# EAGLE design tinypacket (EAGLE 5.10)
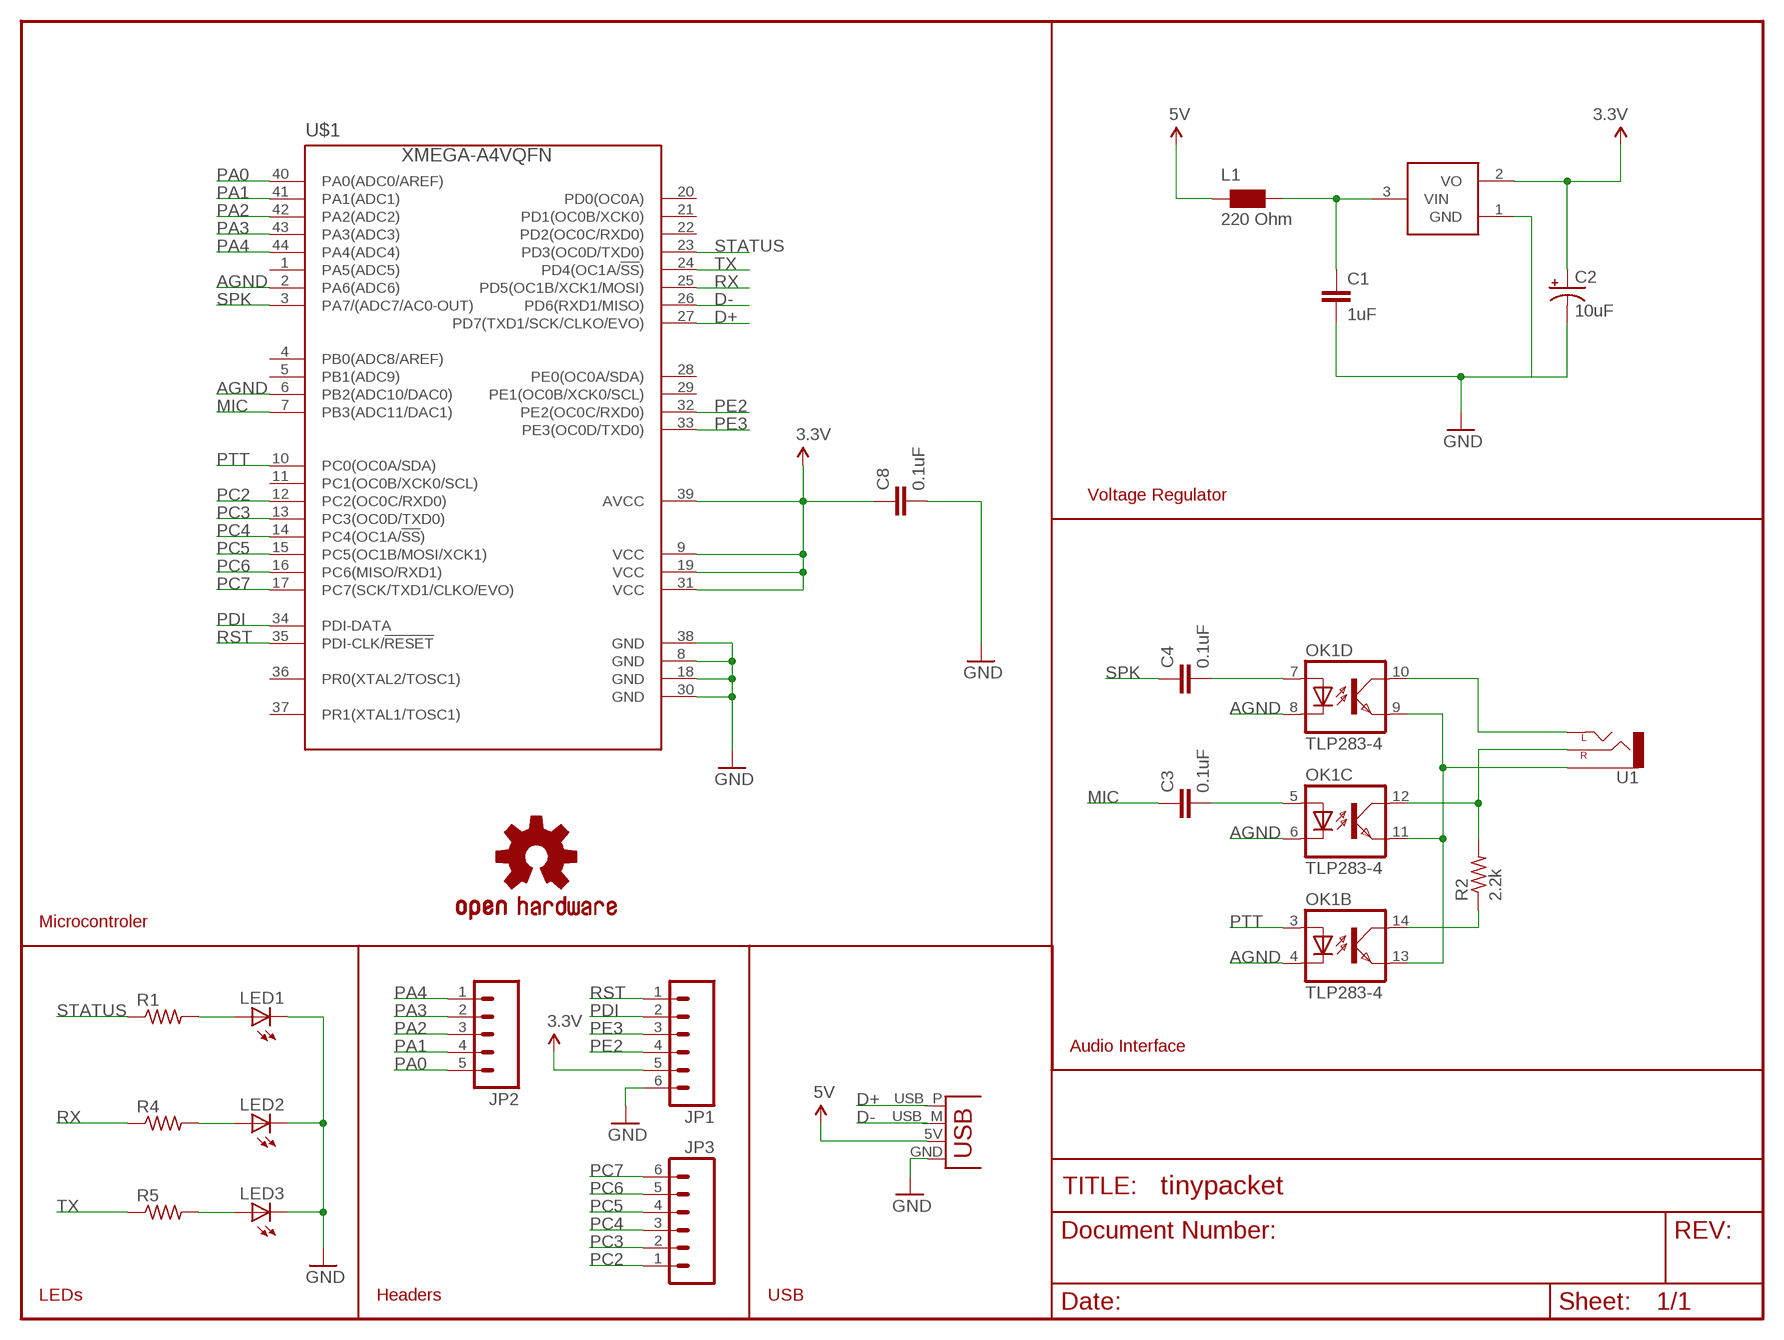
[diagram p0: schematic, sheet 1]

## Parts
C1  1uF  C-EUC0603  [C0603]
C2  10uF  CAP_POL1206  [EIA3216]
C3  0.1uF  C-EUC0603  [C0603]
C4  0.1uF  C-EUC0603  [C0603]
C8  0.1uF  C-EUC0603  [C0603]
JP1  M06SIP  [1X06]
JP2  M05PTH  [1X05]
JP3  M06SIP  [1X06]
L1  220 Ohm  WE-CBF_0603  [0603]
LED1  LED0603  [LED-0603]
LED2  LED0603  [LED-0603]
LED3  LED0603  [LED-0603]
OK1  TLP283-4  [MINI-FLAT-16]
R1  R-US_R0603  [R0603]
R2  2.2k  R-US_R0603  [R0603]
R4  R-US_R0603  [R0603]
R5  R-US_R0603  [R0603]
U1  AUDIO-JACKPTH  [AUDIO-JACK]
U$1  XMEGA-A4VQFN  [QFN44]
U$2  VREG  [SOT23-3]
U$5  OSHW-LOGOS  [OSHW-LOGO-S]
X1  USBPCB  [USB-A-PCB]

## Nets
3.3V: C2.A(+) C8.1 JP1.5 U$1.9(VCC) U$1.19(VCC) U$1.31(VCC) U$1.39(AVCC) U$2.2(VO)
5V: L1.1 X1.5V(VBUS)
5VINT: C1.1 L1.2 U$2.3(VIN)
AGND: OK1.4(B:C) OK1.6(C:C) OK1.8(D:C) U$1.2(PA6(ADC6)) U$1.6(PB2(ADC10/DAC0))
D+: U$1.27(PD7(TXD1/SCK/CLKO/EVO)) X1.USB_P(D+)
D-: U$1.26(PD6(RXD1/MISO)) X1.USB_M(D-)
GND: C1.2 C2.C(-) C8.2 JP1.6 LED1.C LED2.C LED3.C U$1.8(GND) U$1.18(GND) U$1.30(GND) U$1.38(GND) U$2.1(GND) X1.GND
MIC: C3.1 U$1.7(PB3(ADC11/DAC1))
N$1: OK1.12(C:COL) R2.2 U1.RING(RIGHT)
N$2: LED1.A R1.2
N$3: OK1.9(D:EMIT) OK1.11(C:EMIT) OK1.13(B:EMIT) U1.SLEEVE
N$5: OK1.14(B:COL) R2.1
N$6: OK1.10(D:COL) U1.TIP(LEFT)
N$7: C4.2 OK1.7(D:A)
N$8: LED2.A R4.2
N$9: LED3.A R5.2
N$10: C3.2 OK1.5(C:A)
PA0: JP2.5 U$1.40(PA0(ADC0/AREF))
PA1: JP2.4 U$1.41(PA1(ADC1))
PA2: JP2.3 U$1.42(PA2(ADC2))
PA3: JP2.2 U$1.43(PA3(ADC3))
PA4: JP2.1 U$1.44(PA4(ADC4))
PC2: JP3.1 U$1.12(PC2(OC0C/RXD0))
PC3: JP3.2 U$1.13(PC3(OC0D/TXD0))
PC4: JP3.3 U$1.14(PC4(OC1A/!SS!))
PC5: JP3.4 U$1.15(PC5(OC1B/MOSI/XCK1))
PC6: JP3.5 U$1.16(PC6(MISO/RXD1))
PC7: JP3.6 U$1.17(PC7(SCK/TXD1/CLKO/EVO))
PDI: JP1.2 U$1.34(PDI-DATA)
PE2: JP1.4 U$1.32(PE2(OC0C/RXD0))
PE3: JP1.3 U$1.33(PE3(OC0D/TXD0))
PTT: OK1.3(B:A) U$1.10(PC0(OC0A/SDA))
RST: JP1.1 U$1.35(PDI-CLK/!RESET)
RX: R4.1 U$1.25(PD5(OC1B/XCK1/MOSI))
SPK: C4.1 U$1.3(PA7/(ADC7/AC0-OUT))
STATUS: R1.1 U$1.23(PD3(OC0D/TXD0))
TX: R5.1 U$1.24(PD4(OC1A/!SS!))
Unconnected: OK1.1(A:A) OK1.2(A:C) OK1.15(A:EMIT) OK1.16(A:COL) U$1.1(PA5(ADC5)) U$1.4(PB0(ADC8/AREF)) U$1.5(PB1(ADC9)) U$1.11(PC1(OC0B/XCK0/SCL)) U$1.20(PD0(OC0A)) U$1.21(PD1(OC0B/XCK0)) U$1.22(PD2(OC0C/RXD0)) U$1.28(PE0(OC0A/SDA)) U$1.29(PE1(OC0B/XCK0/SCL)) U$1.36(PR0(XTAL2/TOSC1)) U$1.37(PR1(XTAL1/TOSC1))

## Notes on the sheet
- Voltage Regulator
- Microcontroler
- Audio Interface
- LEDs | Headers | USB

## Library data of the parts
C1 C3 C4 C8 = rcl:C-EU: CAPACITOR, European symbol
C2 = sparkfun:CAP_POL: Capacitor Polarized These are standard SMD and PTH capacitors. Normally 10uF, 47uF, and 100uF in electrolytic and tantalum varieties. Always verify the external diameter of the through hole cap, it varies with capacity, voltage, and manufacturer. The EIA devices should be standard.
JP1 JP3 = sparkfun:M06: Header 6 Standard 6-pin 0.1" header. Use with straight break away headers (SKU : PRT-00116), right angle break away headers (PRT-00553), swiss pins (PRT-00743), machine pins (PRT-00117), and female headers (PRT-00115). Molex polarized connector foot print use with SKU : PRT-08094 with associated crimp pins and housings. NOTES ON THE VARIANTS LOCK and LOCK_LONGPADS... This footprint was designed to help hold the alignment of a through-hole component (i.e. 6-pin header) while soldering it into place. You may notice that each hole has been shifted either up or down by 0.005 of an inch from it's more standard position (which is a perfectly straight line). This slight alteration caused the pins (the squares in the middle) to touch the edges of the holes. Because they are alternating, it causes a "brace" to hold the component in place. 0.005 has proven to be the perfect amount of "off-center" position when using our standard breakaway headers. Although looks a little odd when you look at the bare footprint, once you have a header in there, the alteration is very hard to notice. Also, if you push a header all the way into place, it is covered up entirely on the bottom side. This idea of altering the position of holes to aid alignment will be further integrated into the Sparkfun Library for other footprints. It can help hold any component with 3 or more connection pins.
JP2 = sparkfun:M05: Header 5 Standard 5-pin 0.1" header. Use with straight break away headers (SKU : PRT-00116), right angle break away headers (PRT-00553), swiss pins (PRT-00743), machine pins (PRT-00117), and female headers (PRT-00115). Molex polarized connector foot print use with SKU : PRT-08230 with associated crimp pins and housings.
L1 = wuerth-elektronik:WE-CBF: SMD EMI Suppression Ferrite Beads - excellent anti-EMI properties - low DCR - impedances till 3000 ohms - rated current up to 6 A
LED1-LED3 = sparkfun:LED: LEDs Standard schematic elements and footprints for 5mm, 3mm, 1206, and 0603 sized LEDs. 5mm - Spark Fun Electronics SKU : COM-00529 (and others)
OK1 = optocoupler:TLP283-4: TOSHIBA PHOTOCOUPLER GaAs IRED & PHOTO-TRANSISTOR Source: http://www.semicon.toshiba.co.jp/td/en/Opto/Photocoupler/en_20050928_TLP283_datasheet.pdf
R1 R2 R4 R5 = adafruit:R-US_: RESISTOR, American symbol
U1 = sparkfun:AUDIO-JACK: 3.5mm Audio Jack Simple 3.5mm common PCB mount audio jack. SKU: PRT-08032
U$1 = custom:XMEGA-A4: Atmel XMega A4 series processor
U$2 = nonolith:VREG
U$5 = sparkfun:OSHW-LOGO: Open Source Hardware Logo This logo indicates the piece of hardware it is found on incorporates a OSHW license and/or adheres to the definition of open source hardware found here: http://freedomdefined.org/OSHW
X1 = sparkfun:USB: USB Connectors USB-B-PTH is fully proven SKU : PRT-00139 USB-miniB is fully proven SKU : PRT-00587 USB-A-PCB is untested. USB-A-H is throughly reviewed, but untested. Spark Fun Electronics SKU : PRT-00437 USB-B-SMT is throughly reviewed, but untested. Needs silkscreen touching up. USB-A-S has not been used/tested USB-MB-H has not been used/tested

## Board
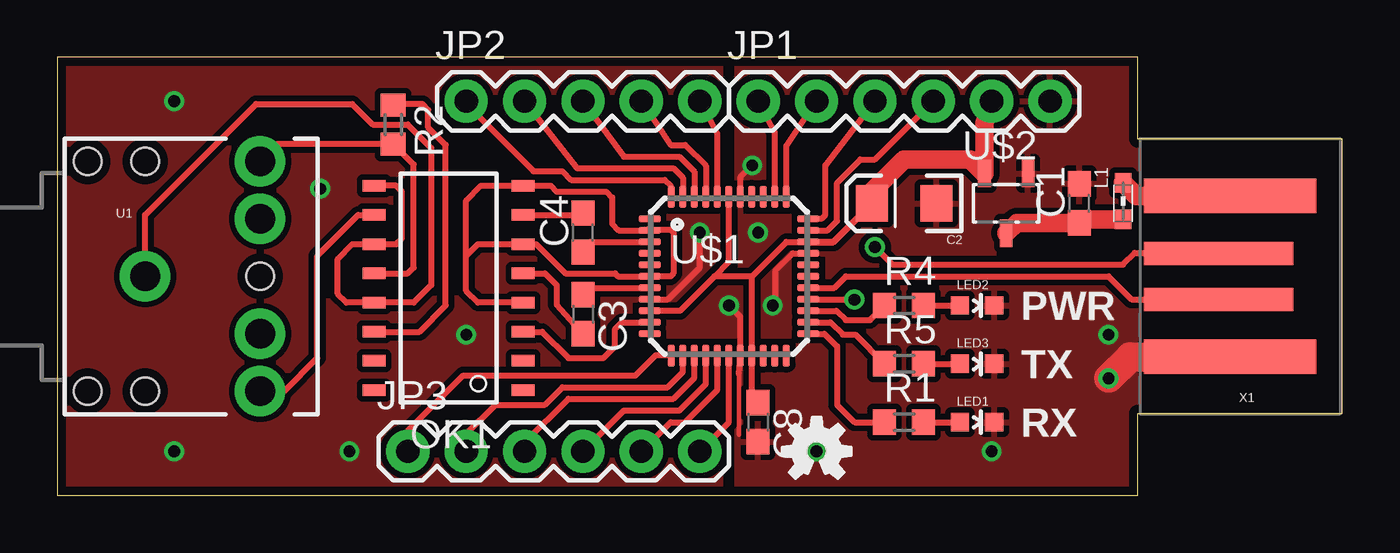
[diagram p1: board, top side]
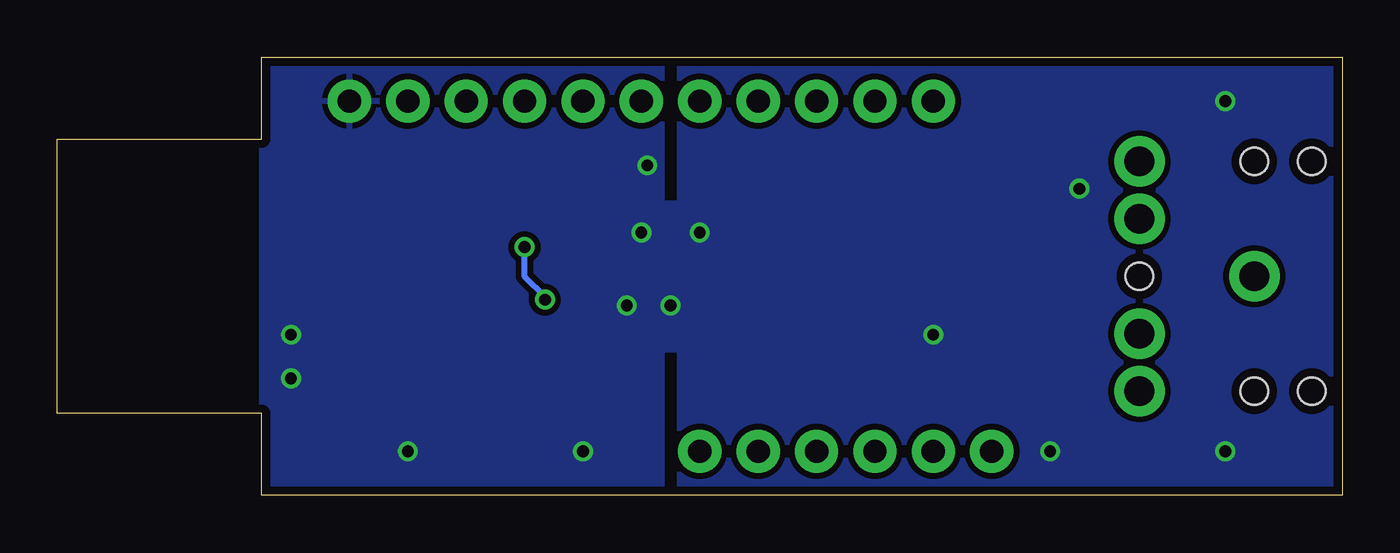
[diagram p2: board, bottom side, seen from below]

Size 55.88 x 19.05 mm. Coordinates in mm from the lower left corner, seen from the top.
Outline: 46.99,15.49 46.99,19.05 0,19.05 0,0 46.99,0 46.99,3.56 55.88,3.56 55.88,15.49 46.99,15.49
Copper layers (1*16): Top 0.0356mm / dielectric 1.5011mm / Bottom 0.0356mm
Design rules "LaenPCBOrder": minimum track width 6mil, minimum drill 13mil, track to track 6mil, track to pad 6mil, pad to pad 6mil, via to via 6mil, smd to smd 6mil, copper to edge 15mil, drill to drill 6mil, minimum pad ring 7mil, minimum via ring 7mil, stop-mask expansion 4mil, vias tented up to drill 0mil, thermal gap 10mil

### Footprints (pad centres in the part's own frame; a part is rotated, then mirrored left to right if it is on the bottom)
C0603 = smd 1.1 x 1: 1 -0.85,0; 2 0.85,0
EIA3216 = smd 1.4 x 1.6: A 1.4,0; C -1.4,0
1X06 = drill 1.016 pad 1.88 round: 1 0,0; 2 2.54,0; 3 5.08,0; 4 7.62,0; 5 10.16,0; 6 12.7,0
1X05 = drill 1.016 pad 1.88 round: 1 0,0; 2 2.54,0; 3 5.08,0; 4 7.62,0; 5 10.16,0
0603 = smd 0.85 x 0.7: 1 -0.9,0; 2 0.7,0
LED-0603 = smd 0.8 x 0.8: A 0,-0.75; C 0,0.75
MINI-FLAT-16 = smd 1 x 0.5: 1 -3.24,4.445; 2 -3.24,3.175; 3 -3.24,1.905; 4 -3.24,0.635; 5 -3.24,-0.635; 6 -3.24,-1.905; 7 -3.24,-3.175; 8 -3.24,-4.445; 9 3.24,-4.445; 10 3.24,-3.175; 11 3.24,-1.905; 12 3.24,-0.635; 13 3.24,0.635; 14 3.24,1.905; 15 3.24,3.175; 16 3.24,4.445
R0603 = smd 1 x 1.1: 1 -0.85,0; 2 0.85,0
AUDIO-JACK = drill 1.3 pad 2.184 round: RING 5,5; RSH 5,2.5; SLEEVE 0,0; TIP 5,-5; TSH 5,-2.5 | hole 1.2: 0,5; -2.5,5; -2.5,-5; 0,-5; 5,0
QFN44 = smd 0.954 x 0.3: 1 -3.452,2.5; 2 -3.452,2; 3 -3.452,1.5; 4 -3.452,1; 5 -3.452,0.5; 6 -3.452,0; 7 -3.452,-0.5; 8 -3.452,-1; 9 -3.452,-1.5; 10 -3.452,-2; 11 -3.452,-2.5; 23 3.452,-2.5; 24 3.452,-2; 25 3.452,-1.5; 26 3.452,-1; 27 3.452,-0.5; 28 3.452,0; 29 3.452,0.5; 30 3.452,1; 31 3.452,1.5; 32 3.452,2; 33 3.452,2.5 | smd 0.3 x 0.954: 12 -2.5,-3.452; 13 -2,-3.452; 14 -1.5,-3.452; 15 -1,-3.452; 16 -0.5,-3.452; 17 0,-3.452; 18 0.5,-3.452; 19 1,-3.452; 20 1.5,-3.452; 21 2,-3.452; 22 2.5,-3.452; 34 2.5,3.452; 35 2,3.452; 36 1.5,3.452; 37 1,3.452; 38 0.5,3.452; 39 0,3.452; 40 -0.5,3.452; 41 -1,3.452; 42 -1.5,3.452; 43 -2,3.452; 44 -2.5,3.452
SOT23-3 = smd 0.55 x 1.2: 1 0.95,1.3; 2 -0.95,1.3; 3 0,-1.3
USB-A-PCB = smd 7.5 x 1.5: 5V -0.2,-3.5; GND -0.2,3.5 | smd 6.5 x 1: USB_M 0.3,-1; USB_P 0.3,1

### Placement (x,y rotation side)
C1  44.45,12.7 90 top
C2  36.83,12.7 180 top
C3  22.86,7.87 270 top
C4  22.86,11.43 90 top
C8  30.48,3.17 270 top
JP1  30.48,17.14 0 top
JP2  17.78,17.14 0 top
JP3  15.24,1.91 0 top
L1  46.35,12.7 270 top
LED1  40.01,3.17 270 top
LED2  40.01,8.26 270 top
LED3  40.01,5.71 270 top
OK1  17.02,9.02 180 top
R1  36.83,3.17 0 top
R2  14.61,16.13 270 top
R4  36.83,8.26 0 top
R5  36.83,5.71 0 top
U1  3.81,9.53 0 top
U$1  29.21,9.53 0 top
U$2  41.27,12.7 0 top
U$5  33.02,1.91 0 top
X1  50.8,9.53 180 top

### Tracks (layer width: path | path; a pad name or v marks a point on that pad's centre or on a via)
3.3V
  Top 0.254: C8.1 30.21,4.29 U$1.19 30.21,9.53 | U$1.9 27.07,8.03 28.57,9.53 | 30.21,9.53 28.57,9.53 | U$1.31 31.71,11.03 30.21,9.53 | U$1.39 29.21,10.16 28.57,9.53
  Top 0.305: U$1.31 33.76,11.03 C2.A
  Top 0.813: JP1.5 40.33,16.2 U$2.2 39.72,14.61 36.83,14.61 35.43,13.21 C2.A
5V
  Top 0.813: X1.5V 46.93,13.03 L1.1
5VINT
  Top 0.813: L1.2 44.6,12 C1.1 41.73,11.85 U$2.3
AGND
  Top 0.254: 17.78,10.41 17.78,12.83 18.41,13.46 OK1.8 21.46,13.46 21.72,13.21 23.88,13.21 24.13,12.95 24.13,11.81 24.42,11.53 U$1.2 25.88,11.53 25.91,11.56 | 17.78,10.41 18.29,10.92 OK1.6 20.83,10.92 22.1,9.65 24.26,9.65 24.38,9.53 U$1.6 | 25.91,9.53 26.67,9.53 26.8,9.65 26.8,11.43 26.67,11.56 25.91,11.56 | 25.91,11.56 25.65,11.56 | OK1.4 18.29,8.38 17.78,8.89 17.78,10.41
D+
  Top 0.254: U$1.27 33.79,9.03 34.29,9.53 45.72,9.53 46.72,8.53 X1.USB_P
D-  (via drill 0.51)
  Top 0.254: U$1.26 34.66,8.53 v34.67,8.51 | v35.56,10.79 36.32,10.03 46.35,10.03 46.86,10.54 50.48,10.54 X1.USB_M
  Bottom 0.254: v35.56,10.79 35.56,9.53 34.67,8.64 v34.67,8.51
GND  (via drill 0.51)
  Top 0.203: 29.64,2.62 29.64,5.28
  Top 0.254: U$1.38 29.71,13.84 v30.23,14.35 | U$1.30 31.99,10.53 31.24,9.78 31.24,8.38 v31.11,8.26 | v29.21,8.26 29.71,7.75 U$1.18 29.72,6.08 | U$1.8 26.56,8.53 27.94,9.91 v27.94,11.43 | 29.64,5.28 29.72,6.08 | 29.72,6.08 29.72,6.1
  Top 1.27: X1.GND 46.66,6.03 v45.72,5.08
  other vias: 5.08,17.14 12.7,1.91 5.08,1.91 33.02,1.91 40.64,1.91 30.48,11.43 45.72,6.99 11.43,13.34 17.78,6.99
  pour Bottom (isolate 0.254): 0,19.05 28.83,19.05 28.83,12.7 29.59,12.7 29.59,19.05 46.99,19.05 46.99,0 29.59,0 29.59,6.35 28.83,6.35 28.83,0 0,0
  pour Top (isolate 0.254): 0,19.05 28.83,19.05 28.83,12.7 29.59,12.7 29.59,19.05 46.99,19.05 46.99,0 29.59,0 29.59,6.35 28.83,6.35 28.83,0 0,0
MIC
  Top 0.254: U$1.7 23.03,9.03 C3.1
N$1
  Top 0.254: OK1.12 15.24,9.65 15.49,9.91 15.49,14.39 R2.2 9.56,15.28 U1.RING
N$2
  Top 0.254: R1.2 LED1.A
N$3
  Top 0.254: OK1.9 14.73,13.46 14.99,13.21 14.99,11.18 14.73,10.92 OK1.11 12.83,10.92 12.19,10.29 12.19,8.76 12.57,8.38 OK1.13 15.49,8.38 16.26,9.14 16.26,15.11 15.24,16.13 13.72,16.13 12.83,17.02 8.64,17.02 3.81,12.19 U1.SLEEVE
N$5
  Top 0.254: OK1.14 15.75,7.11 16.89,8.26 16.89,15.24 16.13,16 16.13,16.76 15.88,17.02 14.64,17.02 R2.1
N$6
  Top 0.254: U1.TIP 9.86,4.53 11.3,5.97 11.3,10.41 13.08,12.19 OK1.10
N$7
  Top 0.254: OK1.7 22.64,12.19 C4.2
N$8
  Top 0.254: R4.2 LED2.A
N$9
  Top 0.254: R5.2 LED3.A
N$10
  Top 0.254: OK1.5 21.21,9.65 21.72,9.14 21.72,8.29 C3.2
PA0
  Top 0.254: U$1.40 28.71,15.74 JP2.5
PA1
  Top 0.254: U$1.41 28.21,14.34 27.3,15.24 26.67,15.24 JP2.4
PA2
  Top 0.254: U$1.42 27.71,14.07 27.05,14.73 24.64,14.73 JP2.3
PA3
  Top 0.254: JP2.2 22.61,14.22 26.8,14.22 27.21,13.81 U$1.43
PA4
  Top 0.254: JP2.1 18.29,16.51 20.7,14.1 21.97,14.1 22.35,13.72 26.42,13.72 26.67,13.46 26.67,13.02 U$1.44
PC2
  Top 0.254: JP3.1 15.24,2.79 17.65,5.21 25.15,5.21 26.04,6.1 26.69,6.1 U$1.12
PC3
  Top 0.254: JP3.2 17.78,2.67 19.05,3.94 21.21,3.94 21.97,4.7 26.54,4.7 27.21,5.37 U$1.13
PC4
  Top 0.254: JP3.3 20.32,2.29 22.23,4.19 26.8,4.19 27.71,5.1 U$1.14
PC5
  Top 0.254: U$1.15 28.21,4.84 27.05,3.68 24.64,3.68 JP3.4
PC6
  Top 0.254: U$1.16 28.71,4.58 27.3,3.17 26.67,3.17 JP3.5
PC7
  Top 0.254: U$1.17 29.21,3.17 JP3.6
PDI
  Top 0.254: U$1.34 31.71,15.2 JP1.2
PE2
  Top 0.254: JP1.4 35.56,14.61 34.92,14.61 33.91,13.59 33.91,11.94 33.5,11.53 U$1.32
PE3
  Top 0.254: U$1.33 32.64,12.05 33.26,12.05 33.4,12.19 33.4,14.35 JP1.3
PTT
  Top 0.254: U$1.10 24.54,7.53 24.26,7.24 24.26,6.48 23.75,5.97 22.23,5.97 21.08,7.11 OK1.3
RST
  Top 0.254: U$1.35 31.21,15.78 JP1.1
RX
  Top 0.254: U$1.25 33.88,8.03 34.29,7.62 35.34,7.62 R4.1
SPK
  Top 0.254: U$1.3 23.18,11.03 C4.1
STATUS
  Top 0.254: U$1.23 33.36,7.03 33.91,6.48 33.91,3.94 34.67,3.17 R1.1
TX
  Top 0.254: U$1.24 33.62,7.53 34.16,6.99 34.71,6.99 R5.1

### Text on the board
tPlace: PWR | TX | RX